# Altium project AMC_Box_Mainboard.PrjPCB (part 2 of 4)

## Sheet IO.SchDoc: LVDS & RS232C
size 420 x 297 mm; Author: G.Kasprowicz; CompanyName: WUT ISE; DrawnBy: G.Kasprowicz; Organization: WUT ISE; Address1: PW ISE; Address2: Nowowiejska 15/19 00-665 Warsaw; Address3: gkasprow@gmail.com; DocumentNumber: 6; Revision: 2; SheetNumber: 6; SheetTotal: 18; ModifiedBy: -; CheckedDate: -; Title2: PHY & connectors; DivGrp: WUT ISE; Designer: G.Kasprowicz; ModifiedDate: -; ProjectName: Sensor Box
Used 2 times, as channels U_IO, U_IO. Parts and nets are listed once, with the designators drawn on the sheet.
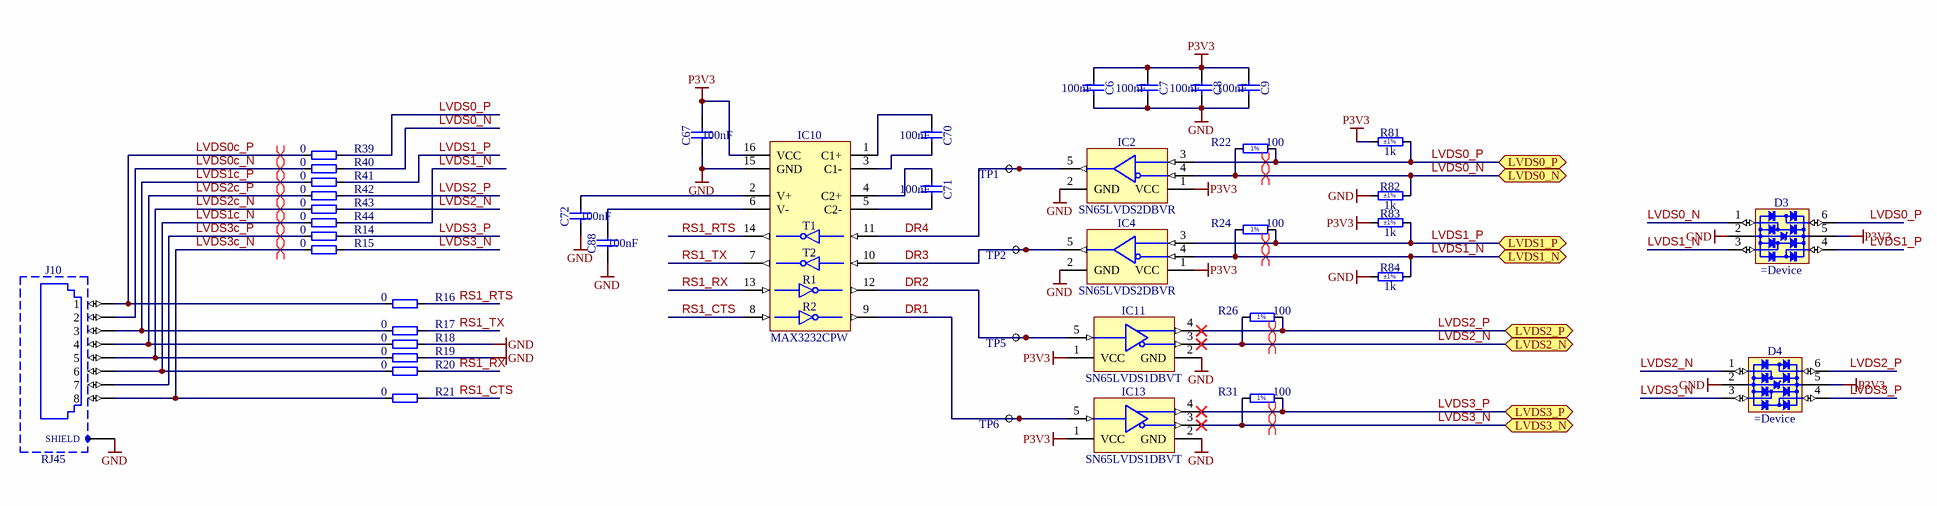
[diagram p3: IO.SchDoc]

### Parts
C6  100nF  [CAPC1005X55N]
C7  100nF  [CAPC1005X55N]
C8  100nF  [CAPC1005X55N]
C9  100nF  [CAPC1005X55N]
C67  100nF  [CAPC1005X55N]
C70  100nF  [CAPC1005X55N]
C71  100nF  [CAPC1005X55N]
C72  100nF  [CAPC1005X55N]
C88  100nF  [CAPC1005X55N]
D3  (no value)  [SOTFL50P160X60-6N]
D4  (no value)  [SOTFL50P160X60-6N]
IC2  SN65LVDS2DBVR  [SOT95P280X145-5N]
IC4  SN65LVDS2DBVR  [SOT95P280X145-5N]
IC10  MAX3232CPW  [SOP65P640X120-16N]
IC11  SN65LVDS1DBVT  [SOT95P280X145-5N]
IC13  SN65LVDS1DBVT  [SOT95P280X145-5N]
J10  RJ45  [FCI_95678-001LF]
R14  0  [RESC1005X40N]
R15  0  [RESC1005X40N]
R16  0  [RESC1005X40N]
R17  0  [RESC1005X40N]
R18  0  [RESC1005X40N]
R19  0  [RESC1005X40N]
R20  0  [RESC1005X40N]
R21  0  [RESC1005X40N]
R22  100  [RESC1005X40N]
R24  100  [RESC1005X40N]
R26  100  [RESC1005X40N]
R31  100  [RESC1005X40N]
R39  0  [RESC1005X40N]
R40  0  [RESC1005X40N]
R41  0  [RESC1005X40N]
R42  0  [RESC1005X40N]
R43  0  [RESC1005X40N]
R44  0  [RESC1005X40N]
R81  1k  Tolerance: ±1%  [RESC1005X40N]
R82  1k  Tolerance: ±1%  [RESC1005X40N]
R83  1k  Tolerance: ±1%  [RESC1005X40N]
R84  1k  Tolerance: ±1%  [RESC1005X40N]
TP1  TP  [TP]  (value not drawn)
TP2  TP  [TP]  (value not drawn)
TP5  TP  [TP]  (value not drawn)
TP6  TP  [TP]  (value not drawn)

### Ports
LVDS0_N (bidir), LVDS0_P (bidir), LVDS1_N (bidir), LVDS1_P (bidir), LVDS2_N (bidir), LVDS2_P (bidir), LVDS3_N (bidir), LVDS3_P (bidir)

### Nets
GND: C6.1 C7.1 C8.1 C9.1 C67.1 C72.2 C88.2 D3.2(GND) D4.2(GND) IC2.2(GND) IC4.2(GND) IC10.15(GND) IC11.2(GND) IC13.2(GND) J10.SHIELD R18.2 R19.2 R82.1 R84.1
P3V3: C6.2 C7.2 C8.2 C9.2 C67.2 D3.5(VBUS) D4.5(VBUS) IC2.1(VCC) IC4.1(VCC) IC10.16(VCC) IC11.1(VCC) IC13.1(VCC) R81.1 R83.1
DR1: IC10.9(R2OUT) IC13.5(R) TP6.1
DR2: IC10.12(R1OUT) IC11.5(R) TP5.1
DR3: IC4.5(R) IC10.10(T2IN) TP2.1
DR4: IC2.5(R) IC10.11(T1IN) TP1.1
LVDS0_N: D3.1(I/O1) IC2.4(B) R22.1 R40.2 R82.2 ; port LVDS0_N
LVDS0_P: D3.6(I/O4) IC2.3(A) R22.2 R39.2 R81.2 ; port LVDS0_P
LVDS0c_N: J10.2 R40.1
LVDS0c_P: J10.1 R16.1 R39.1
LVDS1_N: D3.3(I/O2) IC4.4(B) R24.1 R44.2 R84.2 ; port LVDS1_N
LVDS1_P: D3.4(I/O3) IC4.3(A) R24.2 R41.2 R83.2 ; port LVDS1_P
LVDS1c_N: J10.6 R20.1 R44.1
LVDS1c_P: J10.3 R17.1 R41.1
LVDS2_N: D4.1(I/O1) IC11.3(A) R26.1 R43.2 ; port LVDS2_N
LVDS2_P: D4.6(I/O4) IC11.4(B) R26.2 R42.2 ; port LVDS2_P
LVDS2c_N: J10.5 R19.1 R43.1
LVDS2c_P: J10.4 R18.1 R42.1
LVDS3_N: D4.3(I/O2) IC13.3(A) R15.2 R31.1 ; port LVDS3_N
LVDS3_P: D4.4(I/O3) IC13.4(B) R14.2 R31.2 ; port LVDS3_P
LVDS3c_N: J10.8 R15.1 R21.1
LVDS3c_P: J10.7 R14.1
RS1_CTS: IC10.8(R2IN) R21.2
RS1_RTS: IC10.14(T1OUT) R16.2
RS1_RX: IC10.13(R1IN) R20.2
RS1_TX: IC10.7(T2OUT) R17.2
NetC70_1: C70.1 IC10.3(C1-)
NetC70_2: C70.2 IC10.1(C1+)
NetC71_1: C71.1 IC10.5(C2-)
NetC71_2: C71.2 IC10.4(C2+)
NetC72_1: C72.1 IC10.2(V+)
NetC88_1: C88.1 IC10.6(V-)

### Channels
U_IO: designators end in A; ports LVDS0_N=LVDS0_N LVDS0_P=LVDS0_P LVDS1_N=LVDS1_N LVDS1_P=LVDS1_P LVDS2_N=LVDS2_N LVDS2_P=LVDS2_P LVDS3_N=LVDS3_N LVDS3_P=LVDS3_P
U_IO: designators end in B; ports LVDS0_N=LVDS0_N LVDS0_P=LVDS0_P LVDS1_N=LVDS1_N LVDS1_P=LVDS1_P LVDS2_N=LVDS2_N LVDS2_P=LVDS2_P LVDS3_N=LVDS3_N LVDS3_P=LVDS3_P

### Layout directives
differential pair: LVDS0_N, LVDS0_P, LVDS0c_N_U_IO, LVDS0c_P_U_IO, LVDS1_N, LVDS1_P, LVDS1c_N_U_IO, LVDS1c_P_U_IO, LVDS2_N, LVDS2_P, LVDS2c_N_U_IO, LVDS2c_P_U_IO, LVDS3_N, LVDS3_P, LVDS3c_N_U_IO, LVDS3c_P_U_IO

### Notes on the sheet
- Project/Equipment
- Document
- Designer
- Drawn by
- Check.by
- Copyright WUT ISE 2020.
  This documentation describes Open Hardware and is licensed under the CERN OHL v.1.2. You may redistribute and modify this documentation under the terms of the CERN OHL v.1.2. (http://ohwr.org/CERNOHL). This documentation is distributed WITHOUT ANY EXPRESS OR IMPLIED WARRANTY, INCLUDING OF MERCHANTABILITY, SATISFACTORY QUALITY AND FITNESS FOR A PARTICULAR PURPOSE. Please see the CERN OHL v.1.2 for applicable conditions.
- Contact
- File
- Last Mod.
- Print Date
- Sheet
- Size
- A3
- of
- Rev
- (in symbol MAX3232CPW) T1; T2; R1; R2
- (in symbol R0402_100R_1%_0.0625W_100PPM) 1%

### Library data of the parts
C6-C9 C67 C70-C72 C88 = CC0402_100NF_16V_10%_X5R: Non-polarised capacitor; Part Description: SMD Multilayer Chip Ceramic Capacitor; Manufacturer: GENERIC; Manufacturer1 Part Number: GRM155R61C104KA88D; Voltage: 16V; TC: X5R; Tolerance: ±10%; Part Number: CC0402_100NF_16V_10%_X5R; Component Kind: Standard; Component Type: Standard; Pin Count: 2; Value: 100nF; Status: None; Manufacturer Part Number: CC0402_100NF_16V_10%_X5R; Case: 0402; Mounted: Yes; Socket: No; SMD: Yes; Manufacturer1 Example: MURATA; Manufacturer1 ComponentHeight: 0.55mm; HelpURL: \\cern.ch\dfs\Applications\Altium\Datasheets\CC0402_X5R_MURATA_GRM.pdf; Author: CERN DEM JLC; CreateDate: 10.12.2013; LatestRevisionDate: 10.12.2013; Sense: No
D3 D4 = NUP4114UPXV6T1G: Part Number: NUP4114UPXV6T1G
IC2 IC4 = SN65LVDS2DBVR: High-Speed Differential Line Receiver; Manufacturer: TEXAS INSTRUMENTS; PressFit: No; Bonding: No; Part Number: SN65LVDS2DBVR; Component Kind: Standard; Component Type: Standard; Device: SN65LVDS2DBVR; PackageDescription: SOT, 0.95mm pitch; 5 pin, 1.60mm W X 2.90mm L X 1.45mm H body, IPC Medium Density; Part Description: High-Speed Differential Line Receiver; Manufacturer Part Number: SN65LVDS2DBVR; Pin Count: 5; Case: SOT23-5; Mounted: Yes; Socket: No; SMD: Yes; Sense: No; ComponentHeight: 1.45mm; Author: CERN DEM JLC; HelpURL: \\cern.ch\dfs\Applications\Altium\Datasheets\SN65LVDS2DBVR.pdf; CreateDate: 03.03.2011; LatestRevisionDate: 22.09.2011
IC10 = MAX3232CPW: 3-V To 5.5-V Multichannel RS-232 Line Driver/Receiver With ±15kV IEC ESD Protection; Part Description: 3V To 5.5V Multichannel RS-232 Line Driver/Receiver With ±15kV IEC ESD Protection; Manufacturer: TEXAS INSTRUMENTS; Table: Analog & Interface; Part Number: MAX3232CPW; Component Kind: Standard; Component Type: Standard; Device: MAX3232CPW; PackageDescription: SOP, 0.65mm pitch; 16 pin, 4.40mm W X 5.00mm L X 1.20mm H body IPC Medium Density; Manufacturer Part Number: MAX3232CPW; Pin Count: 16; Case: TSSOP16; Mounted: Yes; Socket: No; SMD: Yes; ComponentHeight: 1.2mm; Author: CERN DEM JLC; HelpURL: \\cern.ch\dfs\Applications\Altium\Datasheets\MAX3232CPW.pdf; CreateDate: 2012-01-09; LatestRevisionDate: 2012-01-10
IC11 IC13 = SN65LVDS1DBVT: High-Speed Differential Line Driver; Manufacturer: TEXAS INSTRUMENTS; PressFit: No; Bonding: No; Part Number: SN65LVDS1DBVT; Component Kind: Standard; Component Type: Standard; Device: SN65LVDS1DBVT; PackageDescription: SOT, 0.95mm pitch; 5 pin, 1.60mm W X 2.90mm L X 1.45mm H body, IPC Medium Density; Part Description: High-Speed Differential Line Driver; Manufacturer Part Number: SN65LVDS1DBVT; Pin Count: 5; Case: SOT23-5; Mounted: Yes; Socket: No; SMD: Yes; Sense: No; ComponentHeight: 1.45mm; Author: CERN DEM JLC; HelpURL: \\cern.ch\dfs\Applications\Altium\Datasheets\SN65LVDS1DBVT.pdf; CreateDate: 22.09.2011; LatestRevisionDate: 22.09.2011
J10 = FCI_95678-001LF: 1 Port, 8 Positions Shielded Snap PEG, CAT5 RJ45 Horizontal Modular Jack; Manufacturer: FCI; PressFit: No; Part Number: FCI_95678-001LF; Component Kind: Standard; Component Type: Standard; Pin Count: 10; Family: RJ45; Mounted: Yes; Socket: No; SMD: No; Sense: No; Status: None; Part Description: 1 Port, 8 Positions Shielded Snap PEG, CAT5 RJ45 Horizontal Modular Jack; Manufacturer Part Number: 95678-001LF; ComponentHeight: 13.99mm; HelpURL: \\cern.ch\dfs\Applications\Altium\Datasheets\FCI_95678-001LF.pdf; Author: CERN DEM BC; CreateDate: 28.07.2015; LatestRevisionDate: 28.07.2015
R14-R21 R39-R44 = R0402_0R_JUMPER: Resistor; Part Description: 1A (0.05R Max DC Resistance) Zero Ohm Jumper; Manufacturer: GENERIC; Manufacturer1 Part Number: 232270591001L; Table: Resistors SMD; Part Number: R0402_0R_JUMPER; Component Kind: Standard; Component Type: Standard; Pin Count: 2; Value: 0; Status: Not recommended; Manufacturer Part Number: R0402_0R_JUMPER; Case: 0402; Mounted: Yes; Socket: No; SMD: Yes; Manufacturer1 Example: YAGEO PHYCOMP; Manufacturer1 ComponentHeight: 0.4mm; HelpURL: \\cern.ch\dfs\Applications\Altium\Datasheets\R0402_Phycomp_RC0402.pdf; Author: CERN DEM JLC; CreateDate: 2007-12-03; LatestRevisionDate: 2012-10-17
R22 R24 R26 R31 = R0402_100R_1%_0.0625W_100PPM: Resistor - 1%; Part Description: General Purpose Thick Film Chip Resistor; Manufacturer: GENERIC; Manufacturer1 Part Number: 232270671001L; TC: ±100ppm/°C; Table: Resistors SMD; Part Number: R0402_100R_1%_0.0625W_100PPM; Component Kind: Standard; Component Type: Standard; Pin Count: 2; Value: 100; Status: Not recommended; Power: 0.0625W; Tolerance: ±1%; Manufacturer Part Number: R0402_100R_1%_0.0625W_100PPM; Case: 0402; Mounted: Yes; Socket: No; SMD: Yes; Manufacturer1 Example: YAGEO PHYCOMP; Manufacturer1 ComponentHeight: 0.4mm; HelpURL: \\cern.ch\dfs\Applications\Altium\Datasheets\R0402_Phycomp_RC0402.pdf; Author: CERN DEM JLC; CreateDate: 2007-12-03; LatestRevisionDate: 2012-10-17
R81-R84 = R0402_1K_1%_0.0625W_100PPM: Resistor - 1%; Part Description: General Purpose Thick Film Chip Resistor; Manufacturer: GENERIC; Manufacturer1 Part Number: 232270671002L; TC: ±100ppm/°C; PressFit: No; Part Number: R0402_1K_1%_0.0625W_100PPM; Component Kind: Standard; Component Type: Standard; Pin Count: 2; Value: 1k; Status: Not Recommended; Power: 0.0625W; Manufacturer Part Number: R0402_1K_1%_0.0625W_100PPM; Case: 0402; Mounted: Yes; Sense: No; Socket: No; SMD: Yes; Manufacturer1 Example: YAGEO PHYCOMP; Manufacturer1 ComponentHeight: 0.4mm; HelpURL: \\cern.ch\dfs\Applications\Altium\Datasheets\R0402_Phycomp_RC0402.pdf; Author: CERN DEM JLC; CreateDate: 03.12.2007; LatestRevisionDate: 17.10.2012
TP1 TP2 TP5 TP6 = TP: Testpoint

## Sheet SFP.SchDoc: SFP connector
size 420 x 297 mm; Author: G.Kasprowicz; CompanyName: WUT ISE; DrawnBy: G.Kasprowicz; Organization: WUT ISE; Address1: PW ISE; Address2: Nowowiejska 15/19 00-665 Warsaw; Address3: gkasprow@gmail.com; DocumentNumber: 10; Revision: 2; SheetNumber: 10; SheetTotal: 18; ModifiedBy: -; CheckedDate: -; Title2: & control; DivGrp: WUT ISE; Designer: G.Kasprowicz; ModifiedDate: -; ProjectName: Sensor Box
Used 2 times, as channels U_SFP, U_SFP. Parts and nets are listed once, with the designators drawn on the sheet.
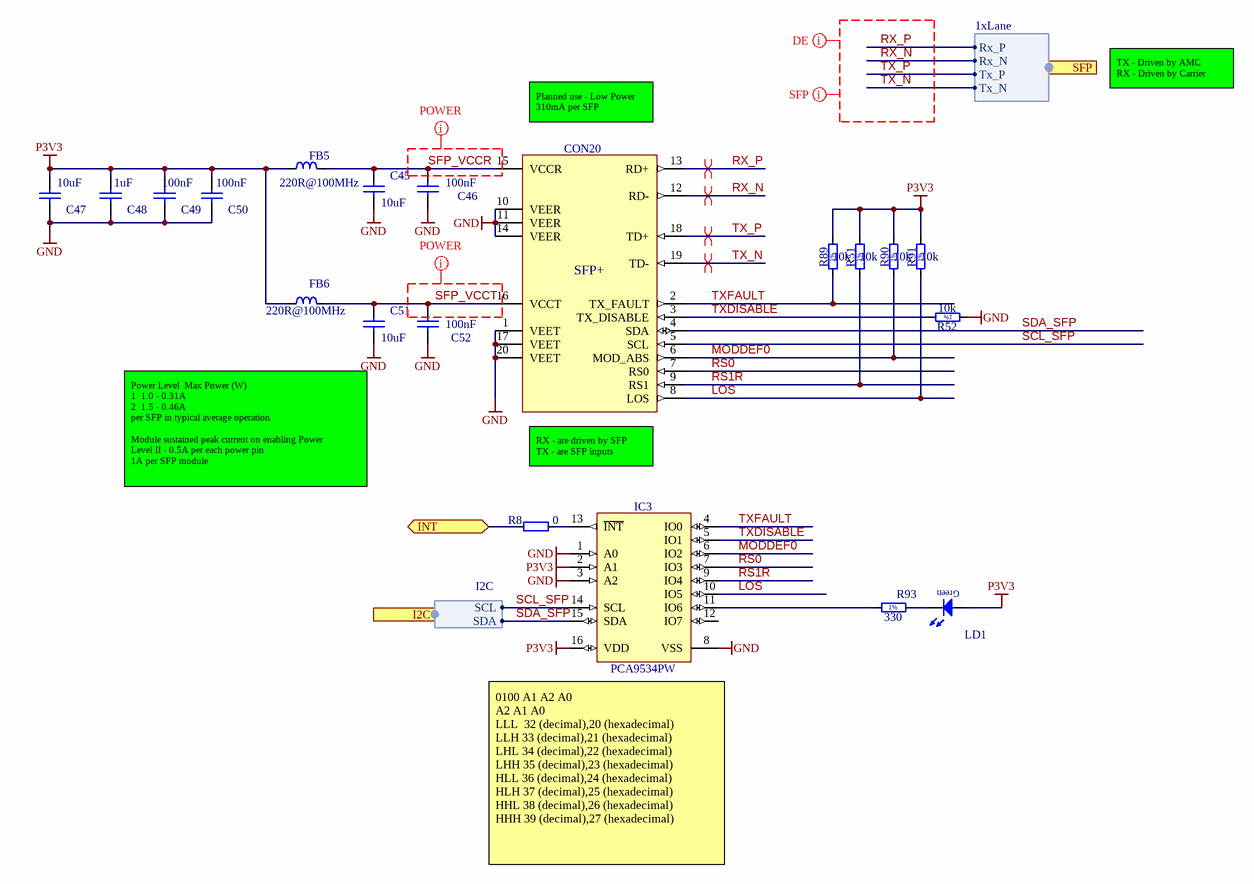
[diagram p4: SFP.SchDoc]

### Parts
C45  10uF  [CAPC2012X135N]
C46  100nF  [CAPC1005X55N]
C47  10uF  [CAPC2012X135N]
C48  1uF  [CAPC1608X87N]
C49  100nF  [CAPC1005X55N]
C50  100nF  [CAPC1005X55N]
C51  10uF  [CAPC2012X135N]
C52  100nF  [CAPC1005X55N]
CON20  1888247-1  [TYCO_1888247-1]  (value not drawn)
FB5  220R@100MHz  [INDC2012X105N]
FB6  220R@100MHz  [INDC2012X105N]
IC3  PCA9534PW  [SOP65P640X110-16N]
LD1  LED_AVAGO_HSME-C120  [LED_AVAGO_HSME-C120]  (value not drawn)
R8  0  [RESC1005X40N]
R51  10k  [RESC1005X40N]
R52  10k  [RESC1005X40N]
R89  10k  [RESC1005X40N]
R90  10k  [RESC1005X40N]
R91  10k  [RESC1005X40N]
R93  330  [RESC1608X55N]

### Ports
I2C (harness I2C), INT (bidir), SFP (harness 1xLane)

### Harnesses
1xLane: Rx_P, Rx_N, Tx_P, Tx_N
I2C: SCL, SDA

### Nets
GND: C45.2 C46.2 C47.2 C48.1 C49.2 C50.2 C51.2 C52.2 CON20.1(VEET) CON20.10(VEER) CON20.11(VEER) CON20.14(VEER) CON20.17(VEET) CON20.20(VEET) IC3.1(A0) IC3.3(A2) IC3.8(VSS) R52.1
P3V3: C47.1 C48.2 C49.1 C50.1 FB5.1 FB6.1 IC3.2(A1) IC3.16(VDD) LD1.2(A) R51.2 R89.2 R90.2 R91.2
INT: R8.1 ; port INT
LOS: CON20.8(LOS) IC3.10(IO5) R91.1
MODDEF0: CON20.6(MOD_ABS) IC3.6(IO2) R90.1
RS0: CON20.7(RS0) IC3.7(IO3)
RS1R: CON20.9(RS1) IC3.9(IO4) R51.1
RX_N: CON20.12(RD-) ; port SFP.Rx_N
RX_P: CON20.13(RD+) ; port SFP.Rx_P
SCL_SFP: CON20.5(SCL) IC3.14(SCL) ; port I2C.SCL
SDA_SFP: CON20.4(SDA) IC3.15(SDA) ; port I2C.SDA
SFP_VCCR: C45.1 C46.1 CON20.15(VCCR) FB5.2
SFP_VCCT: C51.1 C52.1 CON20.16(VCCT) FB6.2
TX_N: CON20.19(TD-) ; port SFP.Tx_N
TX_P: CON20.18(TD+) ; port SFP.Tx_P
TXDISABLE: CON20.3(TX_DISABLE) IC3.5(IO1) R52.2
TXFAULT: CON20.2(TX_FAULT) IC3.4(IO0) R89.1
NetIC3_11: IC3.11(IO6) R93.1
NetIC3_13: IC3.13(~{INT}) R8.2
NetLD1_1: LD1.1(C) R93.2

Not connected (* = marked no-connect by the designer): IC3 12(IO7)

### Channels
U_SFP: designators end in A; ports INT=NetIC20_0
U_SFP: designators end in B; ports INT=NetIC20_0

### Layout directives
differential pair: RX_N, RX_P, SFP2_Tx1_N, SFP2_Tx1_P
net class POWER: SFP_VCCR, SFP_VCCT
net class SFP: RX_N, RX_P, TX_N, TX_P
net class DE: RX_N, RX_P, TX_N, TX_P

### Notes on the sheet
- (near CON20) Planned use - Low Power
  310mA per SFP
- TX - Driven by AMC
  RX - Driven by Carrier
- (near CON20) RX - are driven by SFP
  TX - are SFP inputs
- (near C51) Power Level  Max Power (W)
  1  1.0 - 0.31A
  2  1.5 - 0.46A
  per SFP in typical average operation
  Module sustained peak current on enabling Power
  Level II - 0.5A per each power pin
  1A per SFP module
- (near IC3) 0100 A1 A2 A0
  A2 A1 A0
  LLL 	32 (decimal),20 (hexadecimal)
  LLH	33 (decimal),21 (hexadecimal)
  LHL	34 (decimal),22 (hexadecimal)
  LHH	35 (decimal),23 (hexadecimal)
  HLL	36 (decimal),24 (hexadecimal)
  HLH	37 (decimal),25 (hexadecimal)
  HHL	38 (decimal),26 (hexadecimal)
  HHH	39 (decimal),27 (hexadecimal)
- Project/Equipment
- Document
- Designer
- Drawn by
- Check.by
- Copyright WUT ISE 2020.
  This documentation describes Open Hardware and is licensed under the CERN OHL v.1.2. You may redistribute and modify this documentation under the terms of the CERN OHL v.1.2. (http://ohwr.org/CERNOHL). This documentation is distributed WITHOUT ANY EXPRESS OR IMPLIED WARRANTY, INCLUDING OF MERCHANTABILITY, SATISFACTORY QUALITY AND FITNESS FOR A PARTICULAR PURPOSE. Please see the CERN OHL v.1.2 for applicable conditions.
- Contact
- File
- Last Mod.
- Print Date
- Sheet
- Size
- A3
- of
- Rev
- (in symbol R0402_10K_1%_0.0625W_100PPM) 1%
- (in symbol R0603_330R_1%_0.1W_100PPM) 1%

### Library data of the parts
C45 C47 C51 = CC0805_10UF_10V_10%_X7R: Non-polarised capacitor; Part Description: SMD Multilayer Chip Ceramic Capacitor; Manufacturer: GENERIC; Manufacturer1 Part Number: GRM21BR71A106KE51L; Voltage: 10V; TC: X7R; Tolerance: ±10%; Table: Capacitors SMD; Part Number: CC0805_10UF_10V_10%_X7R; Component Kind: Standard; Component Type: Standard; Pin Count: 2; Value: 10uF; Status: Preferred; Manufacturer Part Number: CC0805_10UF_10V_10%_X7R; Case: 0805; Mounted: Yes; Socket: No; SMD: Yes; Manufacturer1 Example: MURATA; Manufacturer1 ComponentHeight: 1.35mm; HelpURL: \\cern.ch\dfs\Applications\Altium\Datasheets\CC0805_X7R_MURATA.pdf; Author: CERN DEM JLC; CreateDate: 2012-04-30; LatestRevisionDate: 2012-04-30
C46 C49 C50 C52 = CC0402_100NF_16V_10%_X5R: as C6 on sheet IO; Part Number: CC0402_100NF_16V_10%_X5R; Component Kind: Standard; Component Type: Standard; Pin Count: 2; Value: 100nF; Status: None; Manufacturer Part Number: CC0402_100NF_16V_10%_X5R; Case: 0402; Mounted: Yes; Socket: No; SMD: Yes; Manufacturer1 Example: MURATA; Manufacturer1 ComponentHeight: 0.55mm; HelpURL: \\cern.ch\dfs\Applications\Altium\Datasheets\CC0402_X5R_MURATA_GRM.pdf; Author: CERN DEM JLC; CreateDate: 10.12.2013; LatestRevisionDate: 10.12.2013; Sense: No
C48 = CC0603_1UF_25V_10%_X7R: Non-polarised capacitor; Part Description: SMD Multilayer Chip Ceramic Capacitor; Manufacturer: GENERIC; Manufacturer1 Part Number: GRM188R71E105KA12D; Voltage: 25V; TC: X7R; Tolerance: ±10%; Table: Capacitors SMD; Part Number: CC0603_1UF_25V_10%_X7R; Component Kind: Standard; Component Type: Standard; Pin Count: 2; Value: 1uF; Status: None; Manufacturer Part Number: CC0603_1UF_25V_10%_X7R; Case: 0603; Mounted: Yes; Socket: No; SMD: Yes; Manufacturer1 Example: MURATA; Manufacturer1 ComponentHeight: 0.9mm; HelpURL: \\cern.ch\dfs\Applications\Altium\Datasheets\CC0603_X7R_MURATA.pdf; Author: CERN DEM JLC; CreateDate: 2011-01-18; LatestRevisionDate: 2011-01-18
CON20 = TYCO_1888247-1: 20 Position SFP+ Connector (Small Form-factor Pluggable); Part Description: 20 Position, Pitch 0.8mm SFP+  Receptacle (Small Form-factor Pluggable); Manufacturer: TYCO ELECTRONICS; Table: TYCO; Part Number: TYCO_1888247-1; Component Kind: Standard; Component Type: Standard; Pin Count: 20; Family: SFP+; Mounted: Yes; Socket: No; SMD: Yes; Status: None; Manufacturer Part Number: 1888247-1; ComponentHeight: 5.4mm; HelpURL: \\cern.ch\dfs\Applications\Altium\Datasheets\TYCO_1888247-1.pdf; Author: CERN DEM JLC; CreateDate: 2012-02-27; LatestRevisionDate: 2012-02-27
FB5 FB6 = IND0805_MURATA_BLM21PG221SN1D: Inductor; Part Description: SMD EMIFIL Suppression Chip Ferrite Bead; Manufacturer: MURATA; Power: 2A; Resistance: 0.05R; Tolerance: ±25%; Table: Inductors SMD; Part Number: IND0805_MURATA_BLM21PG221SN1D; Component Kind: Standard; Component Type: Standard; Pin Count: 2; Value: 220R@100MHz; Status: None; Manufacturer Part Number: BLM21PG221SN1D; Case: 0805; Mounted: Yes; Socket: No; SMD: Yes; ComponentHeight: 1.05mm; HelpURL: \\cern.ch\dfs\Applications\Altium\Datasheets\IND0402_MURATA_BLM21P.pdf; Author: CERN DEM JLC; CreateDate: 2010-01-25; LatestRevisionDate: 2010-01-25
IC3 = PCA9534PW: 8-Bit I2C-Bus and SMBus Low Power I/O Port with Interrupt; Manufacturer: ANALOG DEVICES; PressFit: No; Bonding: No; Table: Analog & Interface; Part Number: PCA9534PW; Component Kind: Standard; Component Type: Standard; Device: PCA9534PW; PackageDescription: SOP, 0.65mm pitch; 16 pin, 4.40mm W X 5.00mm L X 1.10mm H body IPC Medium Density; Part Description: 8-Bit I2C-Bus and SMBus Low Power I/O Port with Interrupt; Manufacturer Part Number: PCA9534PW; Pin Count: 16; Case: SSOP16; Mounted: Yes; Socket: No; SMD: Yes; ComponentHeight: 1.1mm; Author: CERN DEM JLC; HelpURL: \\cern.ch\dfs\Applications\Altium\Datasheets\PCA9534PW.pdf; CreateDate: 2013-12-18; LatestRevisionDate: 2013-12-18
LD1 = LED_AVAGO_HSME-C120: LED Green 1C 2A; Part Description: High Performance Right Angle Chip Green LED; Manufacturer: AVAGO TECHNOLOGIES; Table: LEDs & Displays; Part Number: LED_AVAGO_HSME-C120; Component Kind: Standard; Component Type: Standard; Color: Green; PackageDescription: Green Chip LED, 2-Leads, Body 1.7x1.1mm, Side Emitting Package; Manufacturer Part Number: HSME-C120; Pin Count: 2; Mounted: Yes; Socket: No; SMD: Yes; ComponentHeight: 0.7mm; HelpURL: \\cern.ch\dfs\Applications\Altium\Datasheets\LED_AVAGO_HSME-C120.pdf; ComponentLink1URL: \\cern.ch\dfs\Applications\Altium\Datasheets\LED_AVAGO_HSME-C110_DESIGN-GUIDE.pdf; ComponentLink1Description: Design Guide; Author: CERN DEM JMW; CreateDate: 2009-07-22; LatestRevisionDate: 2012-06-20
R8 = R0402_0R_JUMPER: as R14 on sheet IO; Part Number: R0402_0R_JUMPER; Component Kind: Standard; Component Type: Standard; Pin Count: 2; Value: 0; Status: Not recommended; Manufacturer Part Number: R0402_0R_JUMPER; Case: 0402; Mounted: Yes; Socket: No; SMD: Yes; Manufacturer1 Example: YAGEO PHYCOMP; Manufacturer1 ComponentHeight: 0.4mm; HelpURL: \\cern.ch\dfs\Applications\Altium\Datasheets\R0402_Phycomp_RC0402.pdf; Author: CERN DEM JLC; CreateDate: 2007-12-03; LatestRevisionDate: 2012-10-17
R51 R52 R89-R91 = R0402_10K_1%_0.0625W_100PPM: Resistor - 1%; Part Description: General Purpose Thick Film Chip Resistor; Manufacturer: GENERIC; Manufacturer1 Part Number: 232270671003L; TC: ±100ppm/°C; Table: Resistors SMD; Part Number: R0402_10K_1%_0.0625W_100PPM; Component Kind: Standard; Component Type: Standard; Pin Count: 2; Value: 10k; Status: Not recommended; Power: 0.0625W; Tolerance: ±1%; Manufacturer Part Number: R0402_10K_1%_0.0625W_100PPM; Case: 0402; Mounted: Yes; Socket: No; SMD: Yes; Manufacturer1 Example: YAGEO PHYCOMP; Manufacturer1 ComponentHeight: 0.4mm; HelpURL: \\cern.ch\dfs\Applications\Altium\Datasheets\R0402_Phycomp_RC0402.pdf; Author: CERN DEM JLC; CreateDate: 2007-12-03; LatestRevisionDate: 2012-10-17
R93 = R0603_330R_1%_0.1W_100PPM: Resistor - 1%; Part Description: General Purpose Thick Film Chip Resistor; Manufacturer: GENERIC; Manufacturer1 Part Number: NRC06F3300TRF; Power: 0.1W; TC: ±100ppm/°C; Table: Resistors SMD; Part Number: R0603_330R_1%_0.1W_100PPM; Component Kind: Standard; Component Type: Standard; Pin Count: 2; Value: 330; Status: Preferred; Tolerance: ±1%; Manufacturer Part Number: R0603_330R_1%_0.1W_100PPM; Case: 0603; Mounted: Yes; Socket: No; SMD: Yes; Manufacturer1 Example: NIC COMPONENT; Manufacturer1 ComponentHeight: 0.55mm; HelpURL: \\cern.ch\dfs\Applications\Altium\Datasheets\R0603_NIC_NRC.pdf; Author: CERN DEM JLC; CreateDate: 2007-12-03; LatestRevisionDate: 2008-03-13

## Sheet I2C_SW.SchDoc: I2C
size 420 x 297 mm; Author: G.Kasprowicz; CompanyName: WUT ISE; DrawnBy: G.Kasprowicz; Organization: WUT ISE; Address1: PW ISE; Address2: Nowowiejska 15/19 00-665 Warsaw; Address3: gkasprow@gmail.com; DocumentNumber: 5; Revision: 2; SheetNumber: 5; SheetTotal: 18; ModifiedBy: -; CheckedDate: -; Title2: Switch; DivGrp: WUT ISE; Designer: G.Kasprowicz; ModifiedDate: -; ProjectName: Sensor Box
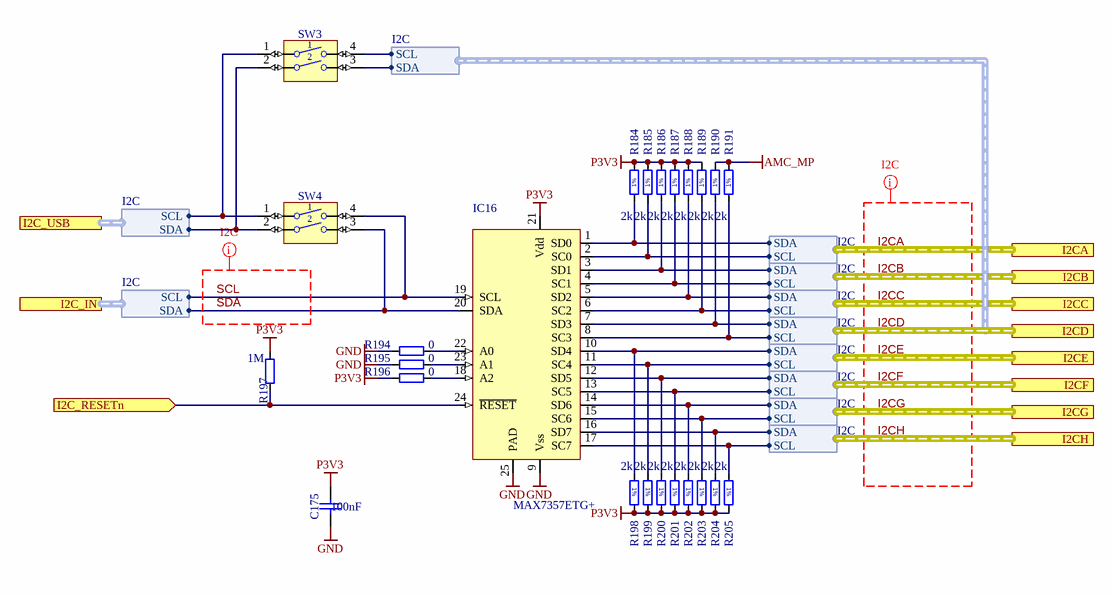
[diagram p5: I2C_SW.SchDoc]

### Parts
C175  100nF  [CAPC1005X55N]
IC16  MAX7357ETG+  [HVQFN24]
R184  2k  [RESC1005X40N]
R185  2k  [RESC1005X40N]
R186  2k  [RESC1005X40N]
R187  2k  [RESC1005X40N]
R188  2k  [RESC1005X40N]
R189  2k  [RESC1005X40N]
R190  2k  [RESC1005X40N]
R191  2k  [RESC1005X40N]
R194  0  [RESC1005X40N]
R195  0  [RESC1005X40N]
R196  0  [RESC1005X40N]
R197  1M  [RESC1005X40N]
R198  2k  [RESC1005X40N]
R199  2k  [RESC1005X40N]
R200  2k  [RESC1005X40N]
R201  2k  [RESC1005X40N]
R202  2k  [RESC1005X40N]
R203  2k  [RESC1005X40N]
R204  2k  [RESC1005X40N]
R205  2k  [RESC1005X40N]
SW3  Switch  [SW_TYCO_1571983-1]  (value not drawn)
SW4  Switch  [SW_TYCO_1571983-1]  (value not drawn)

### Ports
I2C_IN (harness I2C), I2C_RESETn (in), I2C_USB (harness I2C), I2CA (harness I2C), I2CB (harness I2C), I2CC (harness I2C), I2CD (harness I2C), I2CE (harness I2C), I2CF (harness I2C), I2CG (harness I2C), I2CH (harness I2C)

### Harnesses
I2C: SCL, SDA

### Nets
AMC_MP: R190.2 R191.2
GND: C175.1 IC16.9(Vss) IC16.25(PAD) R194.1 R195.1
P3V3: C175.2 IC16.21(Vdd) R184.2 R185.2 R186.2 R187.2 R188.2 R189.2 R196.1 R197.2 R198.2 R199.2 R200.2 R201.2 R202.2 R203.2 R204.2 R205.2
I2C_RESETn: IC16.24(~{RESET}) R197.1 ; port I2C_RESETn
I2CA.SCL: IC16.2(SC0) R185.1 ; port I2CA.SCL
I2CA.SDA: IC16.1(SD0) R184.1 ; port I2CA.SDA
I2CB.SCL: IC16.4(SC1) R187.1 ; port I2CB.SCL
I2CB.SDA: IC16.3(SD1) R186.1 ; port I2CB.SDA
I2CC.SCL: IC16.6(SC2) R189.1 ; port I2CC.SCL
I2CC.SDA: IC16.5(SD2) R188.1 ; port I2CC.SDA
I2CD.SCL: IC16.8(SC3) R191.1 SW3.4 ; port I2CD.SCL
I2CD.SDA: IC16.7(SD3) R190.1 SW3.3 ; port I2CD.SDA
I2CE.SCL: IC16.11(SC4) R199.1 ; port I2CE.SCL
I2CE.SDA: IC16.10(SD4) R198.1 ; port I2CE.SDA
I2CF.SCL: IC16.13(SC5) R201.1 ; port I2CF.SCL
I2CF.SDA: IC16.12(SD5) R200.1 ; port I2CF.SDA
I2CG.SCL: IC16.15(SC6) R203.1 ; port I2CG.SCL
I2CG.SDA: IC16.14(SD6) R202.1 ; port I2CG.SDA
I2CH.SCL: IC16.17(SC7) R205.1 ; port I2CH.SCL
I2CH.SDA: IC16.16(SD7) R204.1 ; port I2CH.SDA
SCL: IC16.19(SCL) SW4.4 ; port I2C_IN.SCL
SDA: IC16.20(SDA) SW4.3 ; port I2C_IN.SDA
NetIC16_18: IC16.18(A2) R196.2
NetIC16_22: IC16.22(A0) R194.2
NetIC16_23: IC16.23(A1) R195.2
NetR85_2: SW3.2 SW4.2 ; port I2C_USB.SDA
NetR107_2: SW3.1 SW4.1 ; port I2C_USB.SCL

### Buses and harness runs
harness I2CA = port I2CA
harness I2CB = port I2CB
harness I2CC = port I2CC
harness I2CD = port I2CD
harness I2CE = port I2CE
harness I2CF = port I2CF
harness I2CG = port I2CG
harness I2CH = port I2CH

### Layout directives
net class I2C: I2CA, I2CB, I2CC, I2CD, I2CE, I2CF, I2CG, I2CH, SCL, SDA

### Notes on the sheet
- Project/Equipment
- Document
- Designer
- Drawn by
- Check.by
- Copyright WUT ISE 2020.
  This documentation describes Open Hardware and is licensed under the CERN OHL v.1.2. You may redistribute and modify this documentation under the terms of the CERN OHL v.1.2. (http://ohwr.org/CERNOHL). This documentation is distributed WITHOUT ANY EXPRESS OR IMPLIED WARRANTY, INCLUDING OF MERCHANTABILITY, SATISFACTORY QUALITY AND FITNESS FOR A PARTICULAR PURPOSE. Please see the CERN OHL v.1.2 for applicable conditions.
- Contact
- File
- Last Mod.
- Print Date
- Sheet
- Size
- A3
- of
- Rev
- (in symbol R0402_2K_1%_0.0625W_100PPM) 1%

### Library data of the parts
C175 = CC0402_100NF_16V_10%_X5R: as C6 on sheet IO; Part Number: CC0402_100NF_16V_10%_X5R; Component Kind: Standard; Component Type: Standard; Pin Count: 2; Value: 100nF; Status: None; Manufacturer Part Number: CC0402_100NF_16V_10%_X5R; Case: 0402; Mounted: Yes; Socket: No; SMD: Yes; Manufacturer1 Example: MURATA; Manufacturer1 ComponentHeight: 0.55mm; HelpURL: \\cern.ch\dfs\Applications\Altium\Datasheets\CC0402_X5R_MURATA_GRM.pdf; Author: CERN DEM JLC; CreateDate: 10.12.2013; LatestRevisionDate: 10.12.2013; Sense: No
IC16 = IIC_MUX_MAX7357ETG+: 8-channel I2C-bus multiplexer with reset, INT and timeout
R184-R191 R198-R205 = R0402_2K_1%_0.0625W_100PPM: Resistor - 1%; Part Description: General Purpose Thick Film Chip Resistor; Manufacturer: GENERIC; Manufacturer1 Part Number: 232270672002L; TC: ±100ppm/°C; PressFit: No; Part Number: R0402_2K_1%_0.0625W_100PPM; Component Kind: Standard; Component Type: Standard; Pin Count: 2; Value: 2k; Status: Not Recommended; Power: 0.0625W; Tolerance: ±1%; Manufacturer Part Number: R0402_2K_1%_0.0625W_100PPM; Case: 0402; Mounted: Yes; Socket: No; SMD: Yes; Manufacturer1 Example: YAGEO PHYCOMP; Manufacturer1 ComponentHeight: 0.4mm; HelpURL: \\cern.ch\dfs\Applications\Altium\Datasheets\R0402_Phycomp_RC0402.pdf; Author: CERN DEM JLC; CreateDate: 03.12.2007; LatestRevisionDate: 17.10.2012; Sense: No
R194-R196 = R0402_0R_JUMPER: Resistor; Part Description: 1A (0.05R Max DC Resistance) Zero Ohm Jumper; Manufacturer: GENERIC; Manufacturer1 Part Number: 232270591001L; PressFit: No; Part Number: R0402_0R_JUMPER; Component Kind: Standard; Component Type: Standard; Pin Count: 2; Value: 0; Status: Not Recommended; Manufacturer Part Number: R0402_0R_JUMPER; Case: 0402; Mounted: Yes; Socket: No; SMD: Yes; Manufacturer1 Example: YAGEO PHYCOMP; Manufacturer1 ComponentHeight: 0.4mm; HelpURL: \\cern.ch\dfs\Applications\Altium\Datasheets\R0402_Phycomp_RC0402.pdf; Author: CERN DEM JLC; CreateDate: 03.12.2007; LatestRevisionDate: 17.10.2012; Sense: No
R197 = R0402_1M_1%_0.0625W_100PPM: Resistor - 1%; Part Description: General Purpose Thick Film Chip Resistor; Manufacturer: GENERIC; Manufacturer1 Part Number: 232270671005L; TC: ±100ppm/°C; PressFit: No; Part Number: R0402_1M_1%_0.0625W_100PPM; Component Kind: Standard; Component Type: Standard; Pin Count: 2; Value: 1M; Status: Not Recommended; Power: 0.0625W; Tolerance: ±1%; Manufacturer Part Number: R0402_1M_1%_0.0625W_100PPM; Case: 0402; Mounted: Yes; Socket: No; SMD: Yes; Manufacturer1 Example: YAGEO PHYCOMP; Manufacturer1 ComponentHeight: 0.4mm; HelpURL: \\cern.ch\dfs\Applications\Altium\Datasheets\R0402_Phycomp_RC0402.pdf; Author: CERN DEM JLC; CreateDate: 03.12.2007; LatestRevisionDate: 17.10.2012; Sense: No
SW3 SW4 = SW_TYCO_1571983-1: 2 Ways SPST DIP Switch; Part Description: 2 Way SPST SMD DIP Switch, Latched, Contact Rating 0.025A 24VDC; Manufacturer: TYCO; Manufacturer Part Number: 1571983-1 or GDH02S04; PressFit: No; Part Number: SW_TYCO_1571983-1; Component Kind: Standard; Component Type: Standard; Pin Count: 4; PackageDescription: Pitch 1.27mm,  Body3.66x6.2mm, 2 Ways SPST Surface-Mount DIP Switch, TYCO GDH Series; Family: Switch; Mounted: Yes; Socket: No; SMD: Yes; Sense: No; Status: None; ComponentHeight: 2.31mm; HelpURL: \\cern.ch\dfs\Applications\Altium\Datasheets\SW_TYCO_1571983-1.pdf; Author: CERN DEM JLC; CreateDate: 08/01/2009; LatestRevisionDate: 08/01/2009

## Sheet Thermal_MGT.SchDoc: Temperature
size 420 x 297 mm; Author: G.Kasprowicz; CompanyName: WUT ISE; DrawnBy: G.Kasprowicz; Organization: WUT ISE; Address1: PW ISE; Address2: Nowowiejska 15/19 00-665 Warsaw; Address3: gkasprow@gmail.com; DocumentNumber: 12; Revision: 2; SheetNumber: 12; SheetTotal: 18; ModifiedBy: -; CheckedDate: -; Title2: management; DivGrp: WUT ISE; Designer: G.Kasprowicz; ModifiedDate: -; ProjectName: Sensor Box
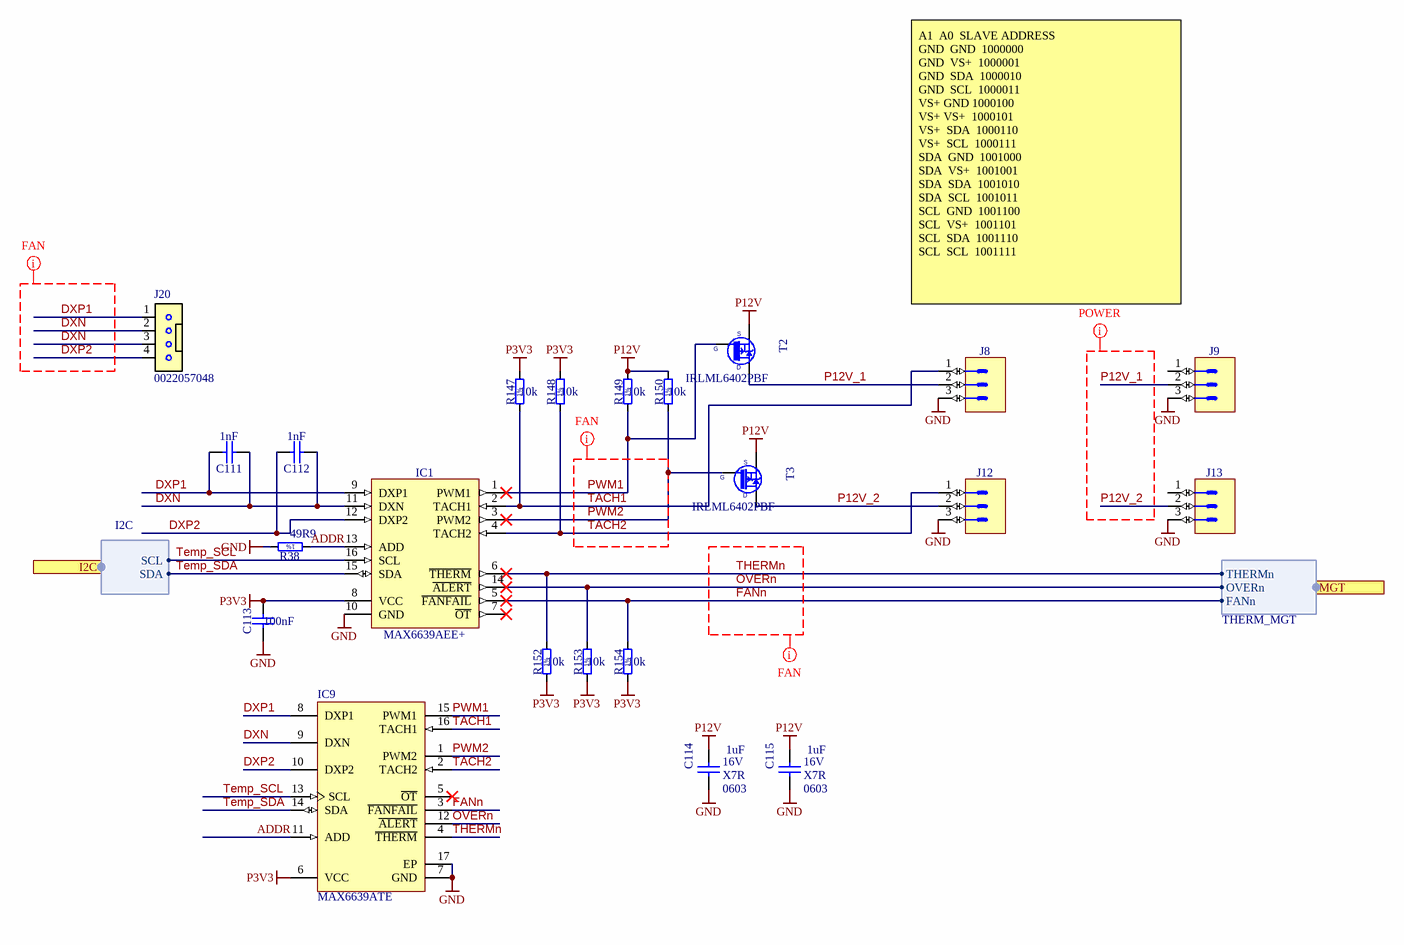
[diagram p6: Thermal_MGT.SchDoc]

### Parts
C111  1nF  [CAPC1005X55N]
C112  1nF  [CAPC1005X55N]
C113  100nF  [CAPC1005X55N]
C114  1uF  Voltage: 16V  TC: X7R  Case: 0603  [CAPC1608X87N]
C115  1uF  Voltage: 16V  TC: X7R  Case: 0603  [CAPC1608X87N]
IC1  MAX6639AEE+  [SOP63P600X175-16N]
IC9  MAX6639ATE  [MAXM-T1655-3_N]
J8  KK®  [MOLEX_22-05-7038]  (value not drawn)
J9  KK®  [MOLEX_22-05-7038]  (value not drawn)
J12  KK®  [MOLEX_22-05-7038]  (value not drawn)
J13  KK®  [MOLEX_22-05-7038]  (value not drawn)
J20  0022057048  [CON_0022057048]
R38  49R9  [RESC1005X40N]
R147  10k  [RESC1005X40N]
R148  10k  [RESC1005X40N]
R149  10k  [RESC1005X40N]
R150  10k  [RESC1005X40N]
R152  10k  [RESC1005X40N]
R153  10k  [RESC1005X40N]
R154  10k  [RESC1005X40N]
T2  IRLML6402PBF  [SOT95P237X112-3N]
T3  IRLML6402PBF  [SOT95P237X112-3N]

### Ports
I2C (harness I2C), MGT (harness THERM_MGT)

### Harnesses
I2C: SCL, SDA
THERM_MGT: OVERn, THERMn, FANn

### Nets
GND: C113.1 C114.1 C115.1 IC1.10(GND) IC9.7(GND) IC9.17(EP) J8.3 J9.3 J12.3 J13.3 R38.2
P3V3: C113.2 IC1.8(VCC) IC9.6(VCC) R147.2 R148.2 R152.1 R153.1 R154.1
P12V: C114.2 C115.2 R149.2 R150.2 T2.2(S) T3.2(S)
ADDR: IC1.13(ADD) IC9.11(ADD) R38.1
DXN: C111.1 C112.1 IC1.11(DXN) IC9.9(DXN) J20.2 J20.3
DXP1: C111.2 IC1.9(DXP1) IC9.8(DXP1) J20.1
DXP2: C112.2 IC1.12(DXP2) IC9.10(DXP2) J20.4
FANn: IC1.5(~{FANFAIL}) IC9.3(~{FANFAIL}) R154.2 ; port MGT.FANn
OVERn: IC1.14(~{ALERT}) IC9.12(~{ALERT}) R153.2 ; port MGT.OVERn
P12V_1: J8.2 J9.2 T2.3(D)
P12V_2: J12.2 J13.2 T3.3(D)
PWM1: IC1.1(PWM1) IC9.15(PWM1) R149.1 T2.1(G)
PWM2: IC1.3(PWM2) IC9.1(PWM2) R150.1 T3.1(G)
TACH1: IC1.2(TACH1) IC9.16(TACH1) J8.1 R147.1
TACH2: IC1.4(TACH2) IC9.2(TACH2) J12.1 R148.1
Temp_SCL: IC1.16(SCL) IC9.13(SCL) ; port I2C.SCL  [project net I2CH.SCL]
Temp_SDA: IC1.15(SDA) IC9.14(SDA) ; port I2C.SDA  [project net I2CH.SDA]
THERMn: IC1.6(~{THERM}) IC9.4(~{THERM}) R152.2 ; port MGT.THERMn

Not connected (* = marked no-connect by the designer): IC1 7(~{OT})*; IC9 5(~{OT})*; J9 1; J13 1

### Layout directives
net class POWER: P12V_1, P12V_2
net class FAN: DXN, DXP1, DXP2, FANn, OVERn, PWM1, PWM2, TACH1, TACH2, THERMn

### Notes on the sheet
- A1 	A0 	SLAVE ADDRESS
  GND 	GND 	1000000
  GND 	VS+ 	1000001
  GND 	SDA 	1000010
  GND 	SCL 	1000011
  VS+	GND	1000100
  VS+	VS+ 	1000101
  VS+ 	SDA 	1000110
  VS+ 	SCL 	1000111
  SDA 	GND 	1001000
  SDA 	VS+ 	1001001
  SDA 	SDA 	1001010
  SDA 	SCL 	1001011
  SCL 	GND 	1001100
  SCL 	VS+ 	1001101
  SCL 	SDA 	1001110
  SCL 	SCL 	1001111
- Project/Equipment
- Document
- Designer
- Drawn by
- Check.by
- Copyright WUT ISE 2020.
  This documentation describes Open Hardware and is licensed under the CERN OHL v.1.2. You may redistribute and modify this documentation under the terms of the CERN OHL v.1.2. (http://ohwr.org/CERNOHL). This documentation is distributed WITHOUT ANY EXPRESS OR IMPLIED WARRANTY, INCLUDING OF MERCHANTABILITY, SATISFACTORY QUALITY AND FITNESS FOR A PARTICULAR PURPOSE. Please see the CERN OHL v.1.2 for applicable conditions.
- Contact
- File
- Last Mod.
- Print Date
- Sheet
- Size
- A3
- of
- Rev
- (in symbol R0402_10K_1%_0.0625W_100PPM) 1%
- (in symbol R0402_49R9_1%_0.0625W_100PPM) 1%

### Library data of the parts
C111 C112 = CC0402_1NF_50V_10%_X7R: Non-polarised capacitor; Part Description: SMD Multilayer Chip Ceramic Capacitor; Manufacturer: GENERIC; Manufacturer1 Part Number: 223858715623; Voltage: 50V; TC: X7R; Tolerance: ±10%; Part Number: CC0402_1NF_50V_10%_X7R; Component Kind: Standard; Component Type: Standard; Pin Count: 2; Value: 1nF; Status: Not Recommended; Manufacturer Part Number: CC0402_1NF_50V_10%_X7R; Case: 0402; Mounted: Yes; Socket: No; SMD: Yes; Manufacturer1 Example: PHYCOMP; Manufacturer1 ComponentHeight: 0.55mm; HelpURL: \\cern.ch\dfs\Applications\Altium\Datasheets\CC0402_X7R_PHYCOMP.pdf; Author: CERN DEM JLC; CreateDate: 03.12.2007; LatestRevisionDate: 03.12.2007; Sense: No
C113 = CC0402_100NF_16V_10%_X5R: as C6 on sheet IO; Part Number: CC0402_100NF_16V_10%_X5R; Component Kind: Standard; Component Type: Standard; Pin Count: 2; Value: 100nF; Status: None; Manufacturer Part Number: CC0402_100NF_16V_10%_X5R; Case: 0402; Mounted: Yes; Socket: No; SMD: Yes; Manufacturer1 Example: MURATA; Manufacturer1 ComponentHeight: 0.55mm; HelpURL: \\cern.ch\dfs\Applications\Altium\Datasheets\CC0402_X5R_MURATA_GRM.pdf; Author: CERN DEM JLC; CreateDate: 10.12.2013; LatestRevisionDate: 10.12.2013; Sense: No
C114 C115 = CC0603_1UF_16V_10%_X7R: Non-polarised capacitor; Part Description: SMD Multilayer Chip Ceramic Capacitor; Manufacturer: GENERIC; Manufacturer1 Part Number: 223824613663; Tolerance: ±10%; Table: Capacitors SMD; Part Number: CC0603_1UF_16V_10%_X7R; Component Kind: Standard; Component Type: Standard; Pin Count: 2; Value: 1uF; Status: Preferred; Manufacturer Part Number: CC0603_1uF_16V_10%_X7R; Mounted: Yes; Socket: No; SMD: Yes; Manufacturer1 Example: PHYCOMP; Manufacturer1 ComponentHeight: 0.87mm; HelpURL: \\cern.ch\dfs\Applications\Altium\Datasheets\CC0805_X5R_PHYCOMP_HC.pdf; Author: CERN DEM JLC; CreateDate: 12/3/2007; LatestRevisionDate: 12/3/2007
IC1 = MAX6639AEE+: 2-Channel Temperature Monitor with Dual, Automatic, PWM Fan-Speed Controller; Manufacturer: MAXIM; Table: Analog & Interface; Part Number: MAX6639AEE+; Component Kind: Standard; Component Type: Standard; Device: MAX6639AEE+; PackageDescription: SOP, 0.635mm pitch; 16 pin, 3.9mm W X 4.895mm L X 1.75mm H Body, IPC Medium Density; Part Description: 2-Channel Temperature Monitor with Dual, Automatic, PWM Fan-Speed Controller; Manufacturer Part Number: MAX6639AEE+; Pin Count: 16; Case: SSOP16; Mounted: Yes; Socket: No; SMD: Yes; ComponentHeight: 1.75mm; Author: CERN DEM JLC; HelpURL: \\cern.ch\dfs\Applications\Altium\Datasheets\MAX6639AEE+.pdf; CreateDate: 2012-08-15; LatestRevisionDate: 2012-08-15
IC9 = CMP-0253-00500-2: 2-Channel Temperature Monitor with Dual, Automatic, PWM Fan-Speed Controller, -40 to 125 degC, 16-Pin QFN (T1655-3); Fan Controller Functions: Remote & Local Sensor; Interface: 2-Wire/I2C/SMBus; ComponentLink1URL: http://www.maximintegrated.com/; DatasheetVersion: Rev. 2; ComponentLink2Description: Datasheet; ComponentLink2URL: http://datasheets.maximintegrated.com/en/ds/MAX6639-MAX6639F.pdf; Code_JEDEC: MO220; Fan Cntrl.: PWM; PackageReference: T1655-3; PartNumber: MAX6639ATE; ComponentLink3URL: http://pdfserv.maximintegrated.com/package_dwgs/21-0140.PDF; Mounting Technology: Surface Mount; PackageDescription: 16-Pin Thin Quad Flatpack, No Leads, Body 5 x 5 mm, Pitch 0.8 mm; ComponentLink3Description: Package Specification; Generic Part Number: MAX6639; PackageVersion: Rev. Q, 09/2011; ComponentLink1Description: Manufacturer URL
J8 J9 J12 J13 = MOLEX_22-05-7038: Connector 3 Male; Part Description: 2.54mm (.100") Pitch KK® Wire-To-Board Header, Right Angle, With Friction Lock, 3 Circuits; Manufacturer: MOLEX; PressFit: No; Part Number: MOLEX_22-05-7038; Component Kind: Standard; Component Type: Standard; Pin Count: 3; Family: KK®; Mounted: Yes; Socket: No; SMD: No; Sense: No; Status: None; Manufacturer Part Number: 22-05-7038; ComponentHeight: 5.8mm; HelpURL: \\cern.ch\dfs\Applications\Altium\Datasheets\MOLEX_22-05-7038.pdf; Author: CERN DEM JLC; CreateDate: 19.09.2012; LatestRevisionDate: 19.09.2012
J20 = CON_4_2.54_RA_key: 2.54mm crimped terminal header
R38 = R0402_49R9_1%_0.0625W_100PPM: Resistor - 1%; Part Description: General Purpose Thick Film Chip Resistor; Manufacturer: GENERIC; Manufacturer1 Part Number: 232270674999L or RC0402FR-0749R9L; TC: ±100ppm/°C; Table: Resistors SMD; Part Number: R0402_49R9_1%_0.0625W_100PPM; Component Kind: Standard; Component Type: Standard; Pin Count: 2; Value: 49R9; Status: Not recommended; Power: 0.0625W; Tolerance: ±1%; Manufacturer Part Number: R0402_49R9_1%_0.0625W_100PPM; Case: 0402; Mounted: Yes; Socket: No; SMD: Yes; Manufacturer1 Example: YAGEO PHYCOMP; Manufacturer1 ComponentHeight: 0.4mm; HelpURL: \\cern.ch\dfs\Applications\Altium\Datasheets\R0402_Phycomp_RC0402.pdf; Author: CERN DEM JLC; CreateDate: 2012-10-24; LatestRevisionDate: 2012-10-24
R147-R150 R152-R154 = R0402_10K_1%_0.0625W_100PPM: as R51 on sheet SFP; Part Number: R0402_10K_1%_0.0625W_100PPM; Component Kind: Standard; Component Type: Standard; Pin Count: 2; Value: 10k; Status: Not recommended; Power: 0.0625W; Tolerance: ±1%; Manufacturer Part Number: R0402_10K_1%_0.0625W_100PPM; Case: 0402; Mounted: Yes; Socket: No; SMD: Yes; Manufacturer1 Example: YAGEO PHYCOMP; Manufacturer1 ComponentHeight: 0.4mm; HelpURL: \\cern.ch\dfs\Applications\Altium\Datasheets\R0402_Phycomp_RC0402.pdf; Author: CERN DEM JLC; CreateDate: 2007-12-03; LatestRevisionDate: 2012-10-17
T2 T3 = IRLML6402PBF: P-CHANNEL MOSFET WITH ZENER DIODE; Part Description: -20V -3.7A P-Channel HEXFET® Power MOSFET; Manufacturer: INTERNATIONAL RECTIFIER; PressFit: No; Bonding: No; Part Number: IRLML6402PBF; Component Kind: Standard; Component Type: Standard; Device: IRLML6402PBF; PackageDescription: SOT, 0.95mm, pitch; 3 pin,1.30mm W X 2.92mm L X 1.12mm H body, IPC Medium Density; Manufacturer Part Number: IRLML6402PBF; Pin Count: 3; Case: SOT23-3; Mounted: Yes; Socket: No; SMD: Yes; Sense: No; ComponentHeight: 1.12mm; HelpURL: \\cern.ch\dfs\Applications\Altium\Datasheets\IRLML6402PBF.pdf; Author: CERN DEM JLC; CreateDate: 8/29/2011; LatestRevisionDate: 8/29/2011